# Altium schematic sheet RTC.SchDoc
size A
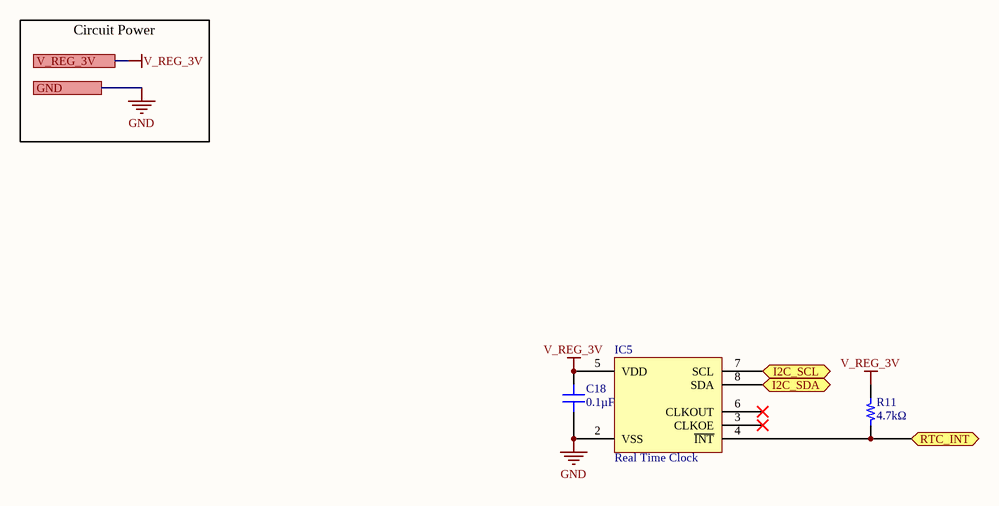
[diagram p0: RTC.SchDoc]

## Parts
C18  0.1µF  [CAP 0402_1005]
IC5  Real Time Clock  [MICRO CRYSTAL 8-SON]
R11  4.7kΩ  [RES 0402_1005 RF]

## Ports
GND, I2C_SCL (bidir), I2C_SDA (bidir), RTC_INT (bidir), V_REG_3V

## Nets
GND: C18.1 IC5.2(VSS) ; port GND
V_REG_3V: C18.2 IC5.5(VDD) R11.2 ; port V_REG_3V
I2C_SCL: IC5.7(SCL) ; port I2C_SCL
I2C_SDA: IC5.8(SDA) ; port I2C_SDA
RTC_INT: IC5.4(~{INT}) R11.1 ; port RTC_INT

Not connected (* = marked no-connect by the designer): IC5 3(CLKOE)* 6(CLKOUT)*

## Notes on the sheet
- Circuit Power

## Library data of the parts
C18 = CAP00001: CAP CER 0.1UF 16V X7R 0402; Manufacturer: KEMET; Manufacturer P/N: C0402C104K4RAC7411; Tolerance: ±10%; Device ID: CAP00001; Mounting Type: Surface Mount; Part Type: Capacitor; VALUE: 0.1µF; Operating Temperature: -55°C ~ 125°C; Voltage: 16V; Package: 0402 (1005 Metric); Supplier1: Digi-Key; Supplier1 P/N: 399-C0402C104K4RAC7411CT-ND; Supplier2: Mouser; Supplier2 P/N: 80-C0402C104K4R7411; Temperature Coefficient: X7R
IC5 = RTC00001: IC RTC CLK/CALENDAR I2C 8-SMT; Manufacturer: Micro Crystal AG; Manufacturer P/N: RV-8263-C7-32.768KHZ-20PPM-TA-QC; Time Format: HH:MM:SS; Date Format: YY-MM-DD-dd; Interface: I²C; Voltage - Supply: 0.9V ~ 5.5V; Current - Timekeeping Max: 240nA @ 3V; Device ID: RTC00001; Part Type: IC; VALUE: Real Time Clock; Package: 8-SON (3.2x1.5); Operating Temperature: -40°C ~ 85°C; Features: Alarm, Leap Year, RAM; Memory Size: -; Voltage - Supply Battery: -; Supplier1: Digi-Key; Supplier1 P/N: 2195-RV-8263-C7-32.768KHZ-20PPM-TA-QCCT-ND; Supplier2: Mouser; Supplier2 P/N: 428-8263C7328K20PTQC
R11 = RES0003B: RES SMD 4.7K OHM 1% 1/8W 0402; Manufacturer: YAGEO; Manufacturer P/N: AC0402FR-7W4K7L; Power: 0.125W; Device ID: RES0003B; VALUE: 4.7kΩ; Mounting Type: Surface Mount; Part Type: Resistor; Operating Temperature: -55°C ~ 155°C; Package: 0402 (1005 Metric); Tolerance: ±1%; Composition: Thick Film; Supplier1: Digi-Key; Supplier1 P/N: 603-AC0402FR-7W4K7L; Supplier2: Mouser; Supplier2 P/N: 603-AC0402FR-7W4K7L